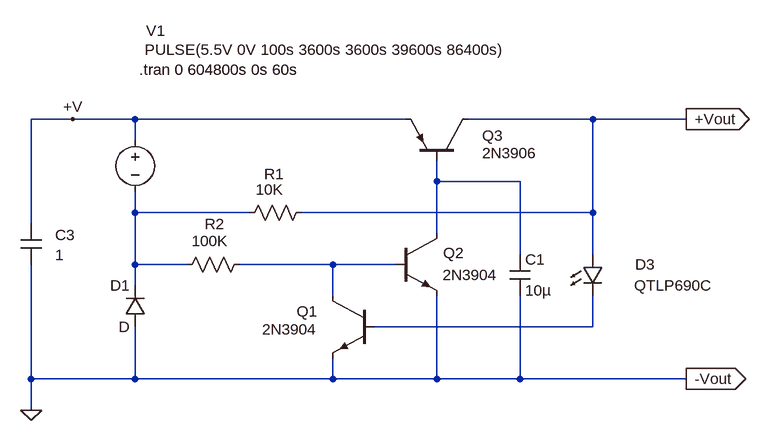
[diagram p0: schematic Nocturnal_Solar_Regulator.asc]
Nocturnal_Solar_Regulator.asc, the LTspice schematic file:
Version 4
SHEET 1 1452 680
WIRE -192 -304 -256 -304
WIRE -96 -304 -192 -304
WIRE 320 -304 -96 -304
WIRE 608 -304 416 -304
WIRE 752 -304 608 -304
WIRE -96 -272 -96 -304
WIRE 368 -208 368 -240
WIRE 496 -208 368 -208
WIRE -96 -160 -96 -192
WIRE 80 -160 -96 -160
WIRE 608 -160 608 -304
WIRE 608 -160 160 -160
WIRE -256 -144 -256 -304
WIRE 368 -128 368 -208
WIRE 496 -96 496 -208
WIRE 608 -96 608 -160
WIRE -96 -80 -96 -160
WIRE -16 -80 -96 -80
WIRE 208 -80 64 -80
WIRE 304 -80 208 -80
WIRE -96 -48 -96 -80
WIRE 208 -32 208 -80
WIRE 608 16 608 -32
WIRE 608 16 272 16
WIRE -256 96 -256 -80
WIRE -96 96 -96 16
WIRE -96 96 -256 96
WIRE 208 96 208 64
WIRE 208 96 -96 96
WIRE 368 96 368 -32
WIRE 368 96 208 96
WIRE 496 96 496 -32
WIRE 496 96 368 96
WIRE 752 96 496 96
WIRE -256 144 -256 96
FLAG 752 -304 +Vout
IOPIN 752 -304 Out
FLAG 752 96 -Vout
IOPIN 752 96 Out
FLAG -256 144 0
FLAG -192 -304 +V
SYMBOL res 176 -176 R90
WINDOW 0 -28 58 VBottom 2
WINDOW 3 -35 65 VTop 2
SYMATTR InstName R1
SYMATTR Value 10K
SYMATTR SpiceLine tol=1 pwr=0.1
SYMBOL res 80 -96 R90
WINDOW 0 -31 54 VBottom 2
WINDOW 3 -36 61 VTop 2
SYMATTR InstName R2
SYMATTR Value 100K
SYMATTR SpiceLine tol=1 pwr=0.1
SYMBOL npn 272 -32 M0
WINDOW 0 87 24 Left 2
WINDOW 3 88 52 Left 2
SYMATTR InstName Q1
SYMATTR Value 2N3904
SYMBOL npn 304 -128 R0
WINDOW 0 74 30 Left 2
WINDOW 3 73 64 Left 2
SYMATTR InstName Q2
SYMATTR Value 2N3904
SYMBOL pnp 416 -240 M270
WINDOW 0 39 -22 VLeft 2
WINDOW 3 12 -22 VLeft 2
SYMATTR InstName Q3
SYMATTR Value 2N3906
SYMBOL cap -272 -144 R0
WINDOW 0 53 18 Left 2
WINDOW 3 53 49 Left 2
SYMATTR InstName C3
SYMATTR Value 1
SYMATTR Description Polarized Capacitor
SYMATTR Type polcap
SYMATTR SpiceLine V=6.3 Irms=0 Rser=0 Lser=0
SYMBOL voltage -96 -288 R0
WINDOW 0 17 -152 Left 2
WINDOW 3 15 -123 Left 2
WINDOW 123 0 0 Left 0
WINDOW 39 0 0 Left 0
SYMATTR InstName V1
SYMATTR Value PULSE(5.5V 0V 100s 3600s 3600s 39600s 86400s)
SYMBOL LED 592 -96 R0
WINDOW 0 81 16 Left 2
WINDOW 3 80 48 Left 2
SYMATTR InstName D3
SYMATTR Value QTLP690C
SYMBOL cap 480 -96 R0
SYMATTR InstName C1
SYMATTR Value 10µ
SYMATTR SpiceLine V=4 Irms=0 Rser=0 Lser=0
SYMBOL diode -80 16 R180
WINDOW 0 24 64 Left 2
WINDOW 3 24 0 Left 2
SYMATTR InstName D1
TEXT -90 -380 Left 2 !.tran 0 604800s 0s 60s

The netlist it stands for:
* Nocturnal_Solar_Regulator.asc
R1 +Vout N002 10K tol=1 pwr=0.1
R2 N003 N002 100K tol=1 pwr=0.1
Q1 N003 N004 0 0 2N3904
Q2 N001 N003 0 0 2N3904
Q3 +Vout N001 +V 0 2N3906
C3 +V 0 1 V=6.3 Irms=0 Rser=0 Lser=0
V1 +V N002 PULSE(5.5V 0V 100s 3600s 3600s 39600s 86400s)
D3 +Vout N004 QTLP690C
C1 N001 0 10µ V=4 Irms=0 Rser=0 Lser=0
D1 0 N002 D
.model D D
.lib standard.dio
.model NPN NPN
.model PNP PNP
.lib standard.bjt
.tran 0 604800s 0s 60s
.backanno
.end

* Results of the author's LTspice run, read from the files saved beside the schematic
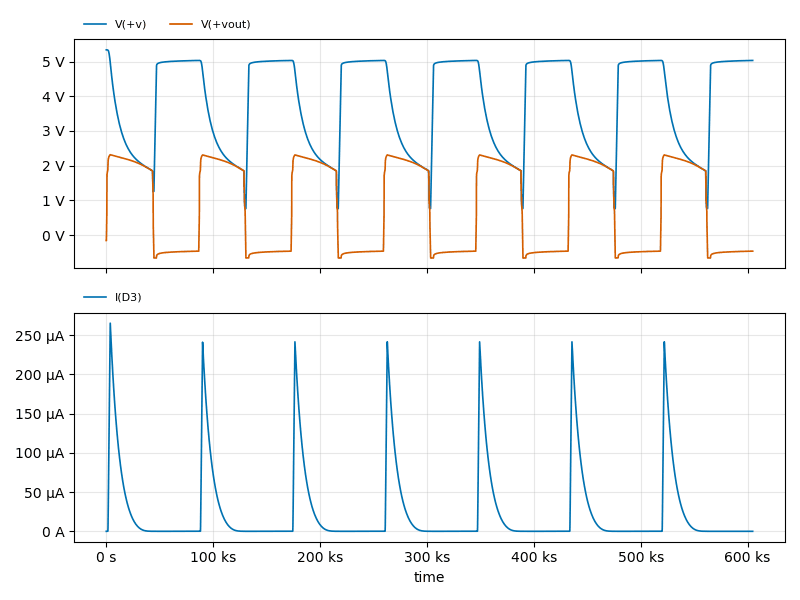
[diagram p1: Transient Analysis of Nocturnal_Solar_Regulator.asc, plotted from the saved traces]
* Transient Analysis, 1 run:
*   V(+v): min 760.6 mV, max 5.34 V, average 3.784 V, rms 4.022 V, last 5.035 V
*   V(+vout): min -663.8 mV, max 2.316 V, average 793.5 mV, rms 1.525 V, last -465.5 mV
*   I(D3): min 0 A, max 265.4 µA, average 24.85 µA, rms 57.96 µA, last 0 A